# Altium schematic sheet VBAT_PROTECTION_REGS.SchDoc
size A
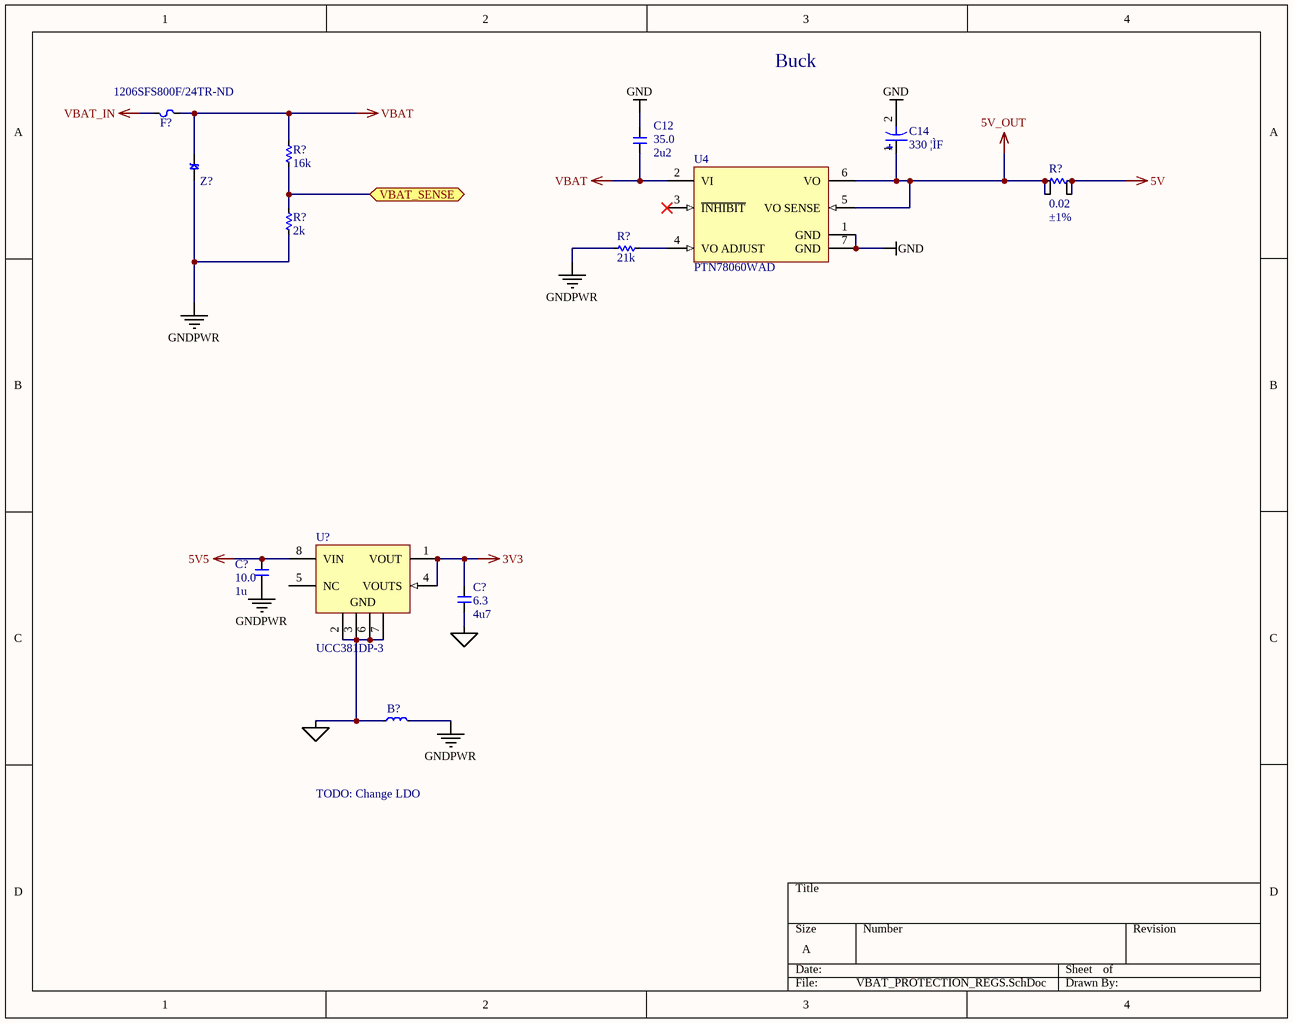
[diagram p0: VBAT_PROTECTION_REGS.SchDoc]

## Parts
(Parts that share a designator on the sheet are numbered #1, #2 ... from top to bottom, then left to right.)
B?  FB_782853112  [R0805]  (value not drawn)
C12  voltage: 35.0  human_value: 2u2  [C1210]  (hidden comment: __template_cap)
C14  330 ¦ÌF  [WCAP-ASLI 8x10.5x3.1]
C?#1  voltage: 10.0  human_value: 1u  [C0603]  (hidden comment: __template_cap)
C?#2  voltage: 6.3  human_value: 4u7  [C0603]  (hidden comment: __template_cap)
F?  Supplier Part Number 1: 1206SFS800F/24TR-ND  [R1206]  (hidden comment: __template_fuse)
R?#1  value 16k  [R0603]  (hidden comment: __template_resistor)
R?#2  Resistance (Ohms): 0.02  Tolerance: ±1%  [R0805_SHUNT]  (hidden comment: RESISTOR .020 OHM 1/4W 1% 0805)  (net tie)
R?#3  value 2k  [R0603]  (hidden comment: __template_resistor)
R?#4  value 21k  [R0603]  (hidden comment: __template_resistor)
U4  PTN78060WAD  [TI-EUW7_V]
U?  UCC381DP-3  [TI-D8_N]
Z?  __template_diode_zener  [DO-214AA]  (value not drawn)

## Ports
VBAT_SENSE

## Nets
3V3: C?#2.1 U?.1(VOUT) U?.4(VOUTS)
5V: R?#2.2 R?#2.4
5V5: C?#1.1 U?.8(VIN)
5V_OUT: C14.1 R?#2.1 R?#2.3 U4.5(VO_SENSE) U4.6(VO)
GDNSIG: B?.1 C?#2.2 U?.2(GND) U?.3(GND) U?.6(GND) U?.7(GND)
GND: C12.1 C14.2 U4.1(GND) U4.7(GND)
GNDPWR: B?.2 C?#1.2 R?#3.1 R?#4.1 Z?.1
VBAT: C12.2 F?.2 R?#1.2 U4.2(VI) Z?.2
VBAT_IN: F?.1
VBAT_SENSE: R?#1.1 R?#3.2 ; port VBAT_SENSE
NetR?#4_2: R?#4.2 U4.4(VO_ADJUST)

Not connected (* = marked no-connect by the designer): U4 3(~{INHIBIT})*; U? 5(NC)

## Notes on the sheet
- Buck
- TODO: Change LDO

## Library data of the parts
B? = FB_782853112: FERRITE BEAD 1100 OHM 800MA; Manufacturer: Wurth Electronics Inc; Supplier 1: Digi-Key; RoHS: RoHS Compliant; Category: Filters; Stock 1: 4000; Pricing 1: 1=0.21, 50=0.19, 100=0.175, 500=0.165, 1000=0.159, 2000=0.15 (USD); ComponentLink1URL: http://katalog.we-online.de/pbs/datasheet/782853112.pdf; ComponentLink1Description: http://katalog.we-online.de/pbs/datasheet/782853112.pdf; Supplier Part Number 1: 732-6713-1-ND; Manufacturer Part Number: 782853112
C12 = 587-1372-1-ND: type: capacitor; value: 2.2e-06; tolerance: 10%; Supplier Part Number 1: 587-1372-1-ND; package: 1210; price: 0.457
C14 = WCAP-ASLI 8x10.5x3.1 865080253011: WCAP-ASLI Aluminum Electrolytic Capacitors , 330 ¦ÌF; + / - 20%; 10 V , 8 x 10,5; Manufacturer: Wurth Elektronik; E-mail: libraries@we-online.com; Characteristics: Aluminum Electrolytic Capacitor;Recommended soldering: Reflow;Operating temperature: ¨C55 ¡ãC to +105 ¡ãC;Low impedance product series;Load life: 2000 h @ +105 ¡ãC; ComponentLink1Description: Manufacturer; ComponentLink1URL: http://www.we-online.com; ComponentLink2Description: Datasheet; ComponentLink2URL: http://katalog.we-online.de/pbs/datasheet/865080253011.pdf; Created by: Karrer Zheng; Created Date: 5/13/2015; Capacitance: 330 ¦ÌF; Application: Energy storage or high frequency filtering in the low voltage circuit; used as power supply filtering in general switching power supply, DC-DC converter, AC-DC converter, conversion adapter, charger, TV, VCR, DC motor circuit filter, digital audio, digital TV, digital camera, digital video camera, satellite receiver, equipment control panel and etc.; partNo: 865080253011
C?#1 = 478-1251-1-ND: type: capacitor; value: 1e-06; tolerance: 10%; Supplier Part Number 1: 478-1251-1-ND; package: 0603; price: 0.138
C?#2 = 399-3482-1-ND: type: capacitor; value: 4.7e-06; tolerance: 10%; Supplier Part Number 1: 399-3482-1-ND; package: 0603; price: 0.18
F? = __template_fuse: Manufacturer: Littelfuse Inc.; Manufacturer Part Number: 1206SFS800F/24-2; Fuse Type: Board Mount (Cartridge Style Excluded); Current Rating: 8A; Voltage Rating - DC: 24V; Response Time: Slow; Breaking Capacity @ Rated Voltage: 60A; Melting I²t: 16.9; Approvals: UL; DC Cold Resistance: 0.009 Ohm; Supplier 1: Digi-Key; RoHS: RoHS Compliant; Category: Circuit Protection; Stock 1: 6000; Pricing 1: 3000=0.31625, 6000=0.3105, 15000=0.299 (USD); Packaging: Tape & Reel (TR); Voltage Rating - AC: -; Package / Case: 1206 (3216 Metric); Mounting Type: Surface Mount; Operating Temperature: -55°C ~ 125°C; Color: -; Size / Dimension: 0.126" L x 0.063" W x 0.038" H (3.20mm x 1.60mm x 0.97mm); ComponentLink1URL: http://www.te.com/commerce/DocumentDelivery/DDEController?Action=srchrtrv&DocNm=CLP00009&DocType=CS&DocLang=English; ComponentLink1Description: http://www.te.com/commerce/DocumentDelivery/DDEController?Action=srchrtrv&DocNm=CLP00009&DocType=CS&DocLang=English
R?#1 = CRCW060316K0FKEA: RES SMD 16K OHM 1% 1/10W 0603; Manufacturer: Vishay Dale; Resistance (Machine readable): 16000; Unit Price (USD): 0.081; Power (Watts): 0.1W, 1/10W; Supplier Part Number: 541-16.0KHCT-ND; Manufacturer Part Number: CRCW060316K0FKEA; type: resistor; Packaging: Cut Tape (CT); Series: CRCW; Tolerance: ±1%; Package: 0603 (1608 Metric)
R?#2 = RES_CURRENT_SENSE_0.020_OHM_0.25W_1%: Manufacturer: Panasonic - ECG; Manufacturer Part Number: ERJ-6BWFR020V; Power (Watts): 0.25W, 1/4W; Temperature Coefficient: ±200ppm/°C; Supplier 1: Digi-Key; RoHS: RoHS Compliant; Category: Resistors; Stock 1: 29378; Pricing 1: 1=0.77, 50=0.569, 100=0.5229, 250=0.4614, 500=0.3845, 1000=0.29991 (USD); Composition: Thick Film; Features: Current Sense; Size / Dimension: 0.079" L x 0.049" W (2.00mm x 1.25mm); Height: 0.030" (0.75mm); Number of Terminations: 2; Packaging: Cut Tape (CT); Package / Case: 0805 (2012 Metric); ComponentLink1URL: http://industrial.panasonic.com/www-data/pdf/AOA0000/AOA0000CE3.pdf; ComponentLink1Description: Datasheet; Supplier Part Number 1: P.02AQCT-ND
R?#3 = CRCW06032K00FKEA: RES SMD 2K OHM 1% 1/10W 0603; Manufacturer: Vishay Dale; Resistance (Machine readable): 2000; Unit Price (USD): 0.081; Power (Watts): 0.1W, 1/10W; Supplier Part Number: 541-2.00KHCT-ND; Manufacturer Part Number: CRCW06032K00FKEA; type: resistor; Packaging: Cut Tape (CT); Series: CRCW; Tolerance: ±1%; Package: 0603 (1608 Metric)
R?#4 = CRCW060321K0FKEA: RES SMD 21K OHM 1% 1/10W 0603; Manufacturer: Vishay Dale; Resistance (Machine readable): 21000; Unit Price (USD): 0.081; Power (Watts): 0.1W, 1/10W; Supplier Part Number: 541-21.0KHCT-ND; Manufacturer Part Number: CRCW060321K0FKEA; type: resistor; Packaging: Cut Tape (CT); Series: CRCW; Tolerance: ±1%; Package: 0603 (1608 Metric)
U4 = PTN78060WAD: 3 A, Wide-Input, Adjustable Switching Regulator Module, -40 to 85 degC, 7-pin Module (EUW7), Pb-Free (RoHS); Manufacturer: Texas Instruments; Iout(Max)(A): 3; Regulated Outputs(#): 1; SubFamily: Non-Isolated POL; Vin(Max)(V): 36; Vin(Min)(V): 7; VO Adjustable: TRUE; Vout(Max)(V): 12.6; Vout(Min)(V): 2.5; DatasheetVersion: SLTS229B; PackageVersion: 4205248-2/B; PackageReference: EUW7; PackageDescription: 7-Pin Plastic Special Shape, Body 15.75 x 25.27 mm; Supplier 1: Digi-Key; Supplier Part Number 1: 296-32723-ND; Supplier 2: Farnell; Supplier Part Number 2: 1109703; Supplier 3: Newark; Supplier Part Number 3: 58K6016; Supplier 4: Newark; Supplier Part Number 4: 92K8255; Supplier 5: Mouser; Supplier Part Number 5: 595-PTN78060WAD; Eco-Plan: Pb-Free (RoHS); Mounting Technology: Through Hole; PartNumber: PTN78060WAD; ComponentLink1Description: Manufacturer URL; ComponentLink1URL: http://www.ti.com/; ComponentLink2Description: Datasheet; ComponentLink2URL: http://www.ti.com/general/docs/lit/getliterature.tsp?genericPartNumber=PTN78060W&fileType=pdf; ComponentLink3Description: Package Specification; ComponentLink3URL: http://www.ti.com/litv/pdf/mpds187; ComponentLink4Description: URL Link1; ComponentLink4URL: Samples URL:http://www.ti.com/product/ptn78060w#samples
U? = UCC381DP-3: Single Output LDO, 1 A, Fixed 3.3 V Output, 3.9 to 9 V Input, with Low IQ, 8-pin SOIC (D), 0 to 70 degC, Green (RoHS & no Sb/Br); Manufacturer: Texas Instruments; Accuracy(%): 2.5; Fixed Output Options(V): 3.3; Iout(Max)(A): 1; Iq(Typ)(mA): 0.4; Rating: Catalog; SubFamily: Single Channel LDO; Vdo(Typ)(mV): 500; Vin(Max)(V): 9; Vin(Min)(V): 3.9; DatasheetVersion: SLUS214B; PackageVersion: 4040047-3/M; PackageReference: D8; PackageDescription: 8-Pin Plastic Small Outline, Body 4.9 x 3.9 mm, Pitch 1.27 mm; Supplier 1: Digi-Key; Supplier Part Number 1: 296-2819-5-ND; Supplier 2: Newark; Supplier Part Number 2: 77C2438; Supplier 3: Mouser; Supplier Part Number 3: 595-UCC381DP-3; Eco-Plan: Green (RoHS & no Sb/Br); Vout Adj(Max)(V): 3.3; Vout Adj(Min)(V): 3.3; Mounting Technology: Surface Mount; Code_JEDEC: MS-012; PartNumber: UCC381DP-3; ComponentLink1Description: Manufacturer URL; ComponentLink1URL: http://www.ti.com/; ComponentLink2Description: Datasheet; ComponentLink2URL: http://www.ti.com/general/docs/lit/getliterature.tsp?genericPartNumber=UCC381-3&fileType=pdf; ComponentLink3Description: Package Specification; ComponentLink3URL: http://www.ti.com/litv/pdf/msoi002j; ComponentLink4Description: URL Link1; ComponentLink4URL: Samples URL:http://www.ti.com/product/ucc381-3#samples
Z? = __template_diode_zener: Manufacturer: ON Semiconductor; Manufacturer Part Number: P6SMB6.8AT3G; Unidirectional Channels: 1; Voltage - Reverse Standoff (Typ): 5.8V; Voltage - Breakdown (Min): 6.45V; Voltage - Clamping (Max) @ Ipp: 10.5V; Current - Peak Pulse (10/1000µs): 57A; Power - Peak Pulse: 600W; Power Line Protection: No; Capacitance @ Frequency: 2380pF @ 1MHz; Supplier 1: Digi-Key; Supplier Part Number 1: P6SMB6.8AT3GOSTR-ND; RoHS: RoHS Compliant; Category: Circuit Protection; Stock 1: 12500; Pricing 1: 2500=0.11006, 5000=0.10339, 12500=0.09672, 25000=0.08871, 62500=0.08538, 125000=0.08204 (USD); Packaging: Tape & Reel (TR); Type: Zener; Bidirectional Channels: -; Applications: Automotive; Operating Temperature: -65°C ~ 150°C (TJ); Mounting Type: Surface Mount; Package / Case: DO-214AA, SMB; Supplier Device Package: SMB; ComponentLink1URL: http://www.onsemi.com/pub_link/Collateral/P6SMB6.8AT3-D.PDF; ComponentLink1Description: http://www.onsemi.com/pub_link/Collateral/P6SMB6.8AT3-D.PDF